# Altium project Moneybox.PrjPcb
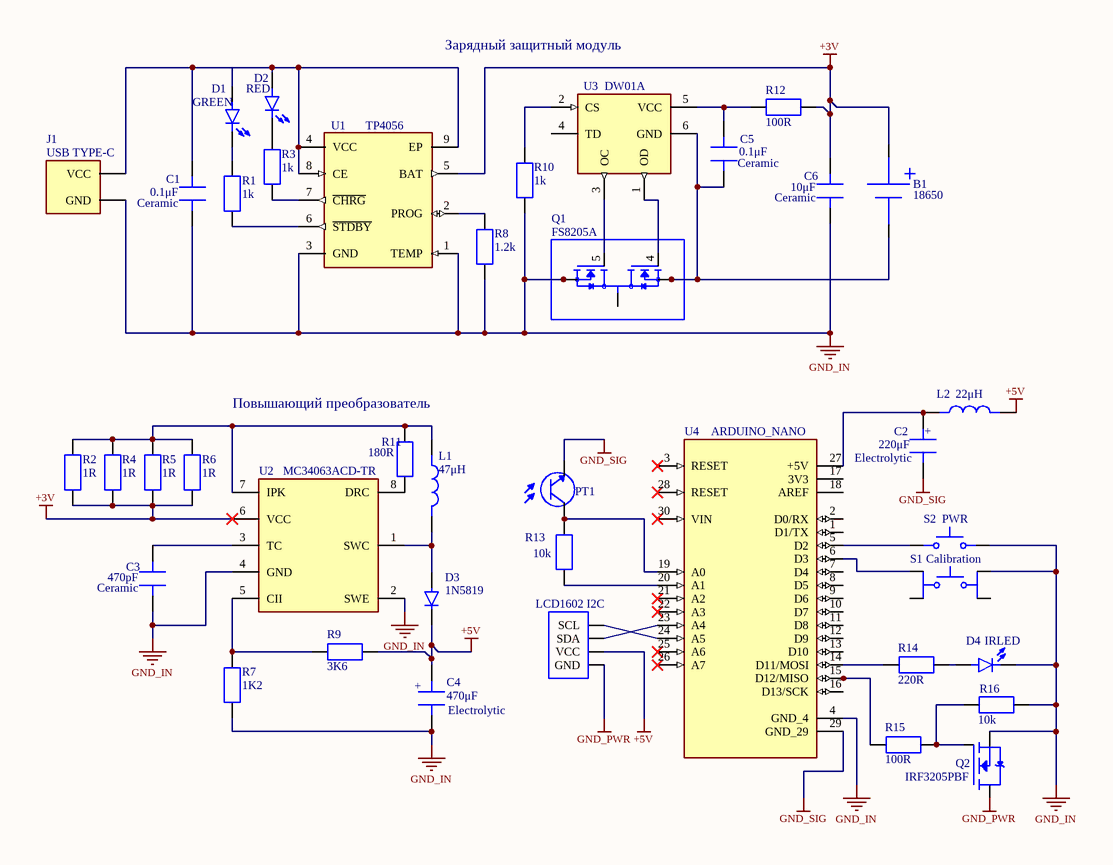
[diagram p0: Moneybox.SchDoc]
1 sheet, 40 parts. Net scope: global (net labels, ports and power ports of the same name join across sheets).
Board file: Moneybox.PcbDoc

## Sheet Moneybox.SchDoc
size A4; SheetNumber: 1; SheetTotal: 1

### Parts
B1  18650  [18650 PLS 2]
C1  value 0.1μF  Types: Ceramic  [R1206]  (hidden comment: Capicator)
C2  value 220μF  Polarity: +  Types: Electrolytic  [CAPICATOR Radial 6.3mm]  (hidden comment: Capicator)
C3  value 470pF  Types: Ceramic  [R1206]  (hidden comment: Capicator)
C4  value 470μF  Polarity: +  Types: Electrolytic  [CAPICATOR Radial 6.3mm]  (hidden comment: Capicator)
C5  value 0.1μF  Types: Ceramic  [R1206]  (hidden comment: Capicator)
C6  value 10μF  Types: Ceramic  [R1206]  (hidden comment: Capicator)
D1  GREEN  [LED_DIP]
D2  RED  [LED_DIP]
D3  1N5819  [DIOD 1N5819]
D4  IRLED  [IRLED_DIP]
J1  USB Type C  [18650 PLS 2]  (value not drawn)
L1  value 47μH  [INDUCTOR THT]  (hidden comment: Inductor THT)
L2  value 22μH  [INDUCTOR THT]  (hidden comment: Inductor THT)
LCD1  LCD1602 I2C  [PLS-4]
PT1  Phototransistors  [Phototransistors DIP]  (value not drawn)
Q1  FS8205A  [FS8205A]
Q2  IRF3205PBF  [MOSFET IRF3205PBF]
R1  value 1k  [R1206]  (hidden comment: Resistor 1206)
R2  value 1R  [R1206]  (hidden comment: Resistor 1206)
R3  value 1k  [R1206]  (hidden comment: Resistor 1206)
R4  value 1R  [R1206]  (hidden comment: Resistor 1206)
R5  value 1R  [R1206]  (hidden comment: Resistor 1206)
R6  value 1R  [R1206]  (hidden comment: Resistor 1206)
R7  value 1K2  [R1206]  (hidden comment: Resistor 1206)
R8  value 1.2k  [R1206]  (hidden comment: Resistor 1206)
R9  value 3K6  [R1206]  (hidden comment: Resistor 1206)
R10  value 1k  [R1206]  (hidden comment: Resistor 1206)
R11  value 180R  [R1206]  (hidden comment: Resistor 1206)
R12  value 100R  [R1206]  (hidden comment: Resistor 1206)
R13  value 10k  [R1206]  (hidden comment: Resistor 1206)
R14  value 220R  [R1206]  (hidden comment: Resistor 1206)
R15  value 100R  [R1206]  (hidden comment: Resistor 1206)
R16  value 10k  [R1206]  (hidden comment: Resistor 1206)
S1  Сalibration  [Tactile Switch]
S2  PWR  [PLS-2]
U1  TP4056  [TP4056]
U2  MC34063ACD-TR  [MC34063ACD-TR_SOIC8]
U3  DW01A  [DW01A]
U4  ARDUINO_NANO  [ARDUINO_NANO]

### Nets
+3V: B1.1 C6.2 R2.1 R4.1 R5.1 R6.1 R12.2 U1.5(BAT) U2.6(VCC)
+5V: C4.1 D3.2 L2.2 LCD1.2(VCC) R9.1
GND_IN: C1.1 C3.1 C4.2 C6.1 D4.2 J1.2(GND) Q1.6(S2) Q1.7(S2) Q2.3(S) R7.1 R8.2 R10.2 R16.2 S1.3 S2.2 U1.1(TEMP) U1.3(GND) U2.2(SWE) U2.4(GND) U4.4(GND_4)
GND_PWR: LCD1.1(GND) Q2.2(D)
GND_SIG: C2.2 PT1.2 U4.29(GND_29)
NetB1_2: B1.2 C5.1 Q1.2(S1) Q1.3(S1) U3.6(GND)
NetC1_2: C1.2 D1.1 D2.1 J1.1(VCC) U1.4(VCC) U1.8(CE) U1.9(EP)
NetC2_1: C2.1 L2.1 U4.27(+5V)
NetC3_2: C3.2 U2.3(TC)
NetC5_2: C5.2 R12.1 U3.5(VCC)
NetD1_2: D1.2 R1.1
NetD2_2: D2.2 R3.1
NetD3_1: D3.1 L1.2 U2.1(SWC)
NetD4_1: D4.1 R14.2
NetL1_1: L1.1 R2.2 R4.2 R5.2 R6.2 R11.2 U2.7(IPK)
NetLCD1_3: LCD1.3(SDA) U4.23(A4)
NetLCD1_4: LCD1.4(SCL) U4.24(A5)
NetPT1_1: PT1.1 R13.2 U4.19(A0)
NetQ1_1: Q1.1(D12) Q1.8(D12)
NetQ1_4: Q1.4(G1) U3.1(OD)
NetQ1_5: Q1.5(G2) U3.3(OC)
NetQ2_1: Q2.1(G) R15.2 R16.1
NetR1_2: R1.2 U1.6(~{STDBY})
NetR3_2: R3.2 U1.7(~{CHRG})
NetR7_2: R7.2 R9.2 U2.5(CII)
NetR8_1: R8.1 U1.2(PROG)
NetR10_1: R10.1 U3.2(CS)
NetR11_1: R11.1 U2.8(DRC)
NetR13_1: R13.1 U4.20(A1)
NetR14_1: R14.1 U4.14(D11/MOSI)
NetR15_1: R15.1 U4.15(D12/MISO)
NetS1_1: S1.1 U4.6(D3)
NetS2_1: S2.1 U4.5(D2)

Not connected (* = marked no-connect by the designer): S1 2 4; U3 4(TD); U4 1(D1/TX) 2(D0/RX) 3(RESET)* 7(D4) 8(D5) 9(D6) 10(D7) 11(D8) 12(D9) 13(D10) 16(D13/SCK) 17(3V3) 18(AREF) 21(A2)* 22(A3)* 25(A6)* 26(A7)* 28(RESET)* 30(VIN)*

### Notes on the sheet
- (near U3) Зарядный защитный модуль
- Повышающий преобразователь
- (in symbol USB Type C) USB TYPE-C

### Library data of the parts
B1 = Baterry 18650
C1 C3 C5 C6 = Capicator: Polarity: +
D1 D2 D4 = IRLED: infrared LED 850nm; MP: WP7113ID; MF: Kingbright; Price: None; Package: Radial Kingbright; Check_prices: https://www.snapeda.com/parts/WP7113ID/Kingbright/view-part/?ref=eda; Purchase-URL: https://pricing.snapeda.com/search/part/WP7113ID/?ref=eda; Availability: In Stock; Value: *; SnapEDA_Link: https://www.snapeda.com/parts/WP7113ID/Kingbright/view-part/?ref=snap
D3 = 1N5819: 1A, 40V, Planar Schottky; MF: Taiwan Semiconductor; SnapEDA_Link: https://www.snapeda.com/parts/1N5819/taiwan/view-part/?ref=snap; Package: DO-41-2 Taiwan Semiconductor; Value: *; MP: 1N5819; Check_prices: https://www.snapeda.com/parts/1N5819/taiwan/view-part/?ref=eda
J1 = USB Type C: USB Type C, Power Only, Top mount, Center Height 1.68mm, Single Row, Surface Mount; MF: Amphenol; MP: GSB1C411101DSHR; SnapEDA_Link: https://www.snapeda.com/parts/GSB1C411101DSHR/Amphenol/view-part/?ref=snap; Package: None; Value: *; Check_prices: https://www.snapeda.com/parts/GSB1C411101DSHR/Amphenol/view-part/?ref=eda
L1 L2 = Inductor THT: Inductor THT axial; MF: TDK Electronics; MP: B78108S1102K000; SnapEDA_Link: https://www.snapeda.com/parts/B78108S1102K000/TDK/view-part/?ref=snap; Package: None; Check_prices: https://www.snapeda.com/parts/B78108S1102K000/TDK/view-part/?ref=eda
PT1 = Phototransistors: Phototransistors 850nm Top View Radial; MF: Vishay; MP: BPW85A; SnapEDA_Link: https://www.snapeda.com/parts/BPW85A/Vishay+Semiconductor+Opto+Division/view-part/?ref=snap; Package: Radial Vishay; Value: *; Check_prices: https://www.snapeda.com/parts/BPW85A/Vishay+Semiconductor+Opto+Division/view-part/?ref=eda
Q1 = FS8205A: MF: Fortune Semiconductor; SnapEDA_Link: https://www.snapeda.com/parts/FS8205A/Fortune+Semiconductor/view-part/?ref=snap; Package: Package; Value: *; MP: FS8205A; Check_prices: https://www.snapeda.com/parts/FS8205A/Fortune+Semiconductor/view-part/?ref=eda
Q2 = IRF3205PBF: MOSFET, Power,N-Ch,VDSS 55V,RDS(ON) 8 Milliohms,ID 110A,TO-220AB,PD 200W,gFS 44S | Infineon IRF3205PBF; MF: Infineon Technologies; SnapEDA_Link: https://www.snapeda.com/parts/IRF3205PBF/Infineon/view-part/?ref=snap; Package: TO-220-3 Infineon; Value: *; MP: IRF3205PBF; Check_prices: https://www.snapeda.com/parts/IRF3205PBF/Infineon/view-part/?ref=eda
R1-R16 = R1206: Parameter 2: *
S1 = Tactile Switch: MP: TL1105AF160Q; Value: *; Package: None; Price: None; Availability: Unavailable
S2 = Switch PLS-2: MP: TL1105AF160Q; Value: *; Package: None; Price: None; Availability: Unavailable
U1 = TP4056: Complete single cell Li-Ion battery with a constant current / constant voltage linear charger; MF: NanJing Top Power ASIC Corp.; Check_prices: https://www.snapeda.com/parts/TP4056/NanJing+Top+Power+ASIC+Corp./view-part/?ref=eda; SnapEDA_Link: https://www.snapeda.com/parts/TP4056/NanJing+Top+Power+ASIC+Corp./view-part/?ref=snap; Price: None; Availability: Not in stock; Package: Package; MP: TP4056; Value: *
U2 = MC34063ACD-TR: Buck, Boost Switching Regulator IC Positive or Negative Adjustable 1.25V 1 Output 1.5A (Switch) 8-SOIC (0.154, 3.90mm Width); MF: STMicroelectronics; SnapEDA_Link: https://www.snapeda.com/parts/MC34063ACD-TR/STMicroelectronics/view-part/?ref=snap; Package: None; Value: *; MP: MC34063ACD-TR; Check_prices: https://www.snapeda.com/parts/MC34063ACD-TR/STMicroelectronics/view-part/?ref=eda
U3 = DW01A: One Cell Lithium-ion/Polymer Battery Protection IC; MF: Fortune Semiconductor; SnapEDA_Link: https://www.snapeda.com/parts/DW01A/Fortune+Semiconductor/view-part/?ref=snap; Package: SOT-23-6 Fortune Semiconductor; Value: *; MP: DW01A; Check_prices: https://www.snapeda.com/parts/DW01A/Fortune+Semiconductor/view-part/?ref=eda
U4 = ARDUINO_NANO: ATmega328 Arduino Nano; SnapEDA_Link: https://www.snapeda.com/parts/Arduino%20Nano/Arduino/view-part/?ref=snap; Package: Non-Standard Arduino; Value: *; MF: Arduino; MP: Arduino Nano; Check_prices: https://www.snapeda.com/parts/Arduino%20Nano/Arduino/view-part/?ref=eda